# Altium project NZPP.PrjPcb
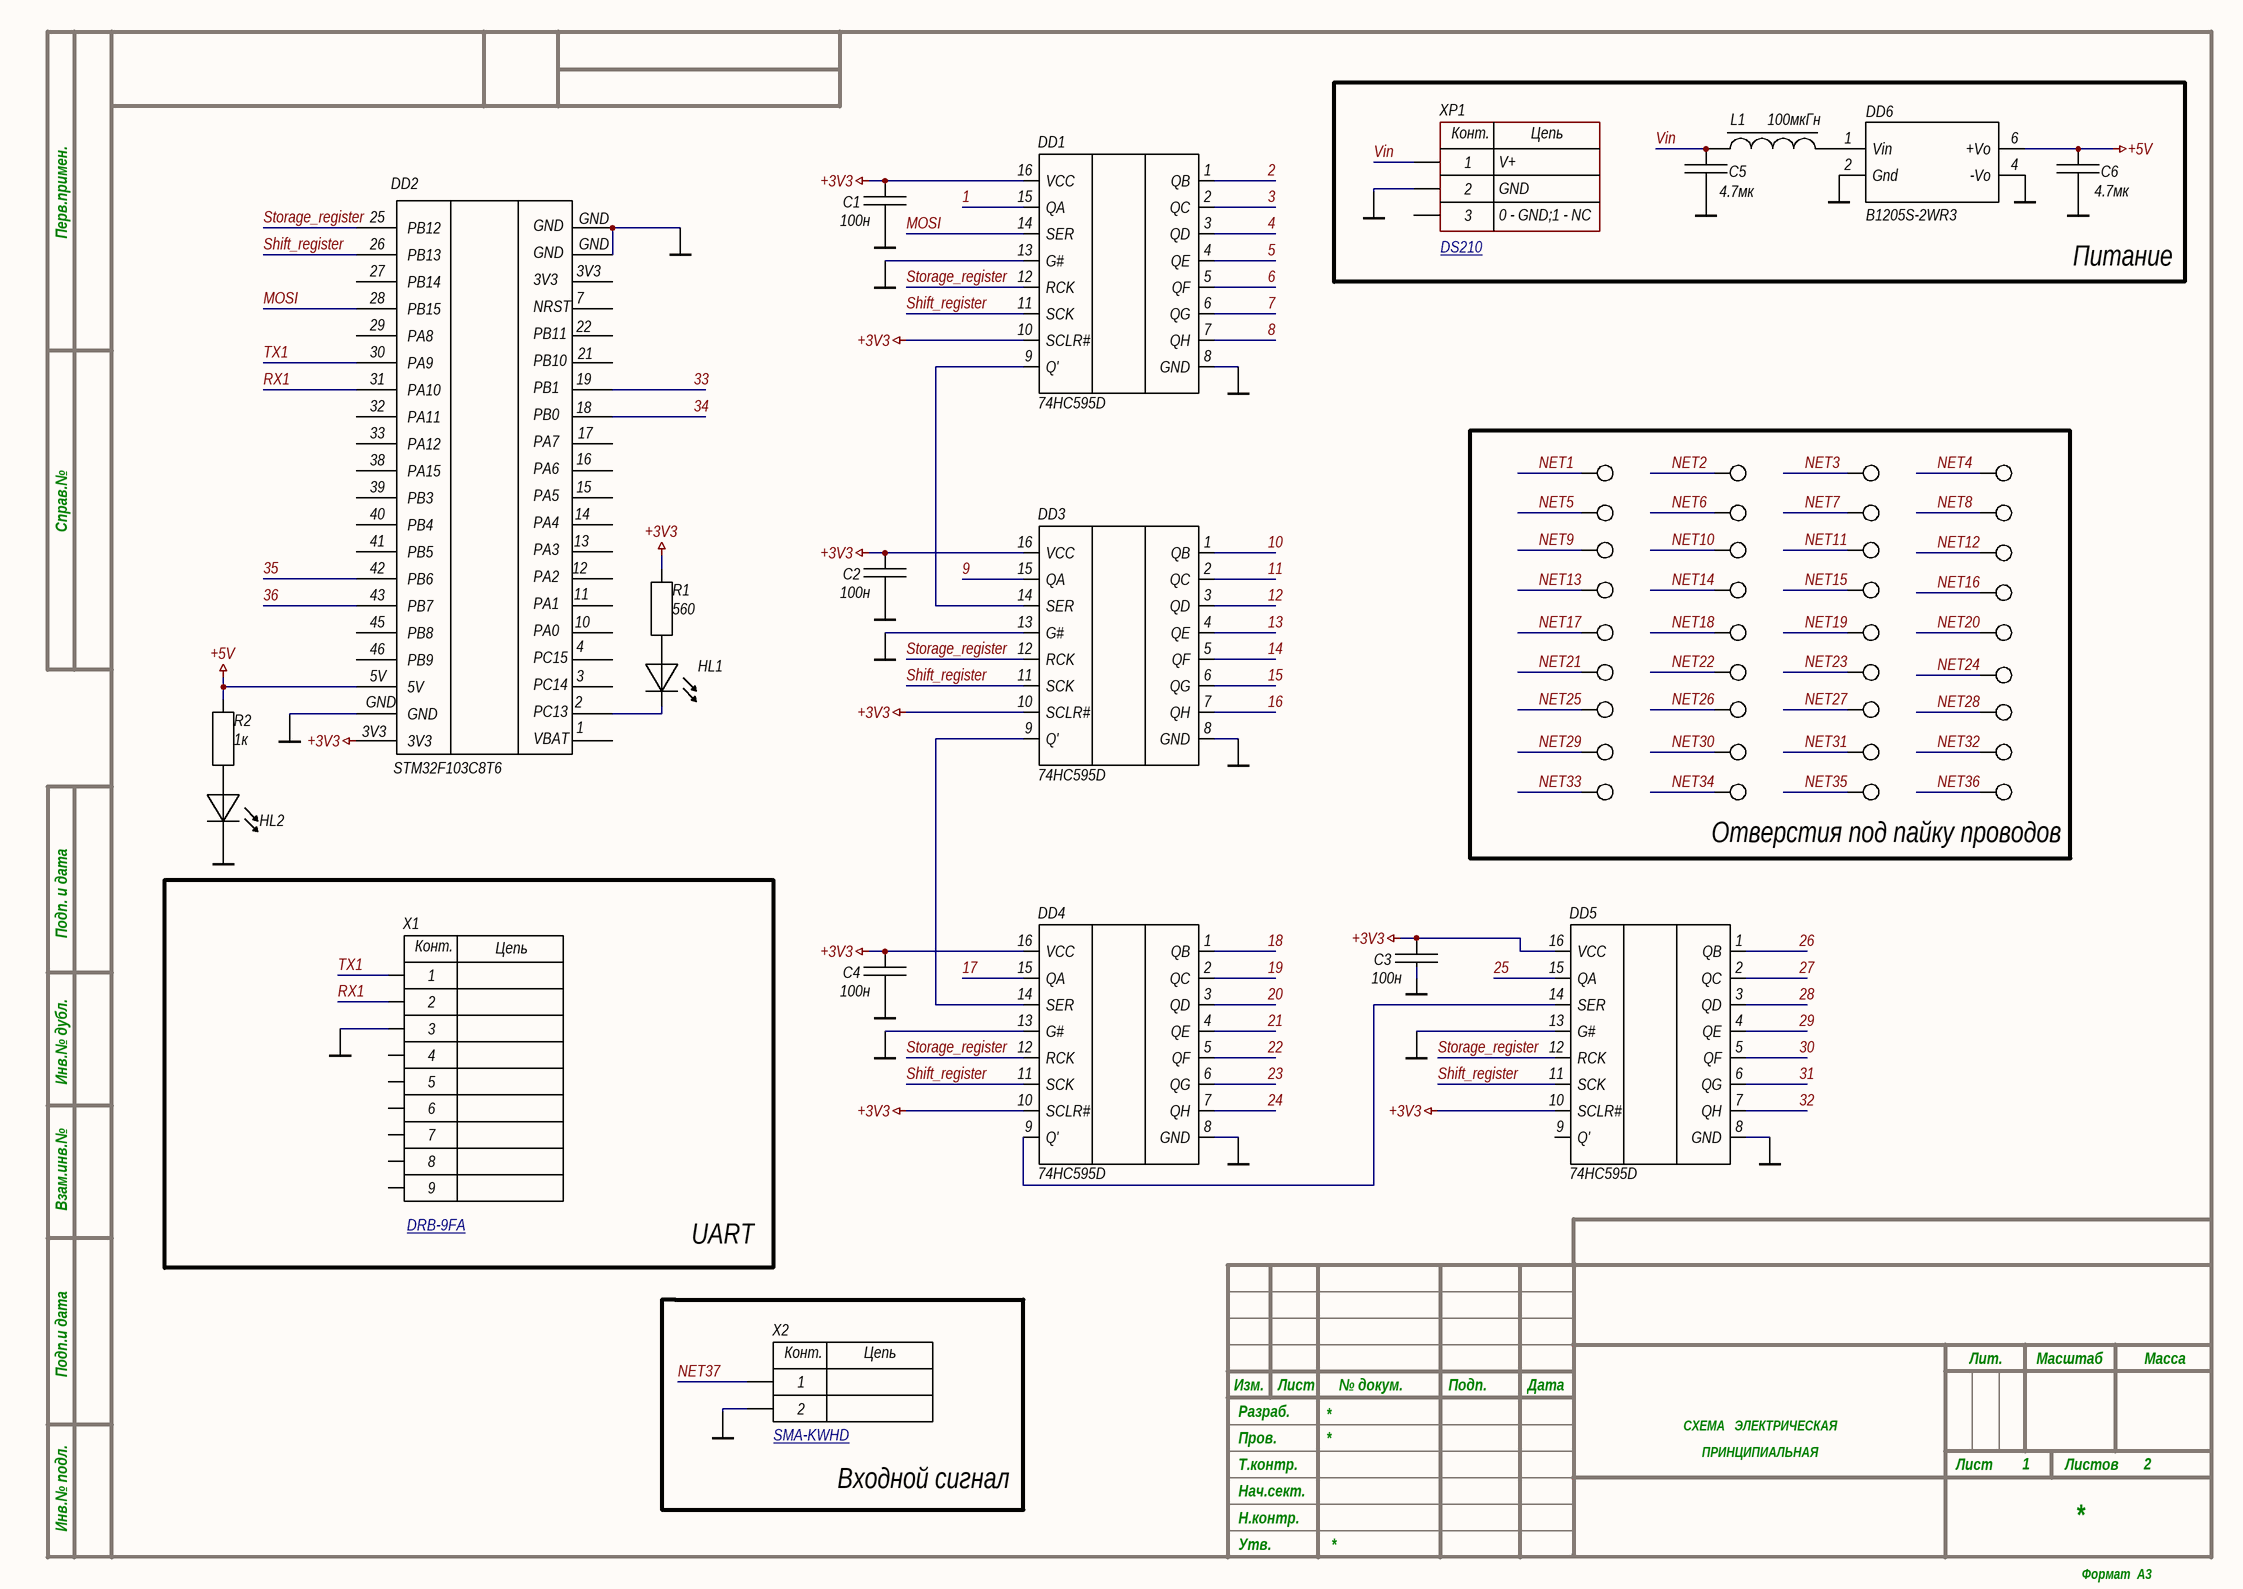
[diagram p0: 1.NZPP.SchDoc]
2 sheets, 164 parts. Net scope: global (net labels, ports and power ports of the same name join across sheets).
Board file: NZPP.PcbDoc
Sheets:
  1.NZPP.SchDoc
  2.NZPP.SchDoc

## Sheet 1.NZPP.SchDoc
size 420 x 297 mm; SheetNumber: 1; SheetTotal: 2

### Parts
*  Point  [Point]  (value not drawn)
*1  Point  [Point]  (value not drawn)
*2  Point  [Point]  (value not drawn)
*3  Point  [Point]  (value not drawn)
*4  Point  [Point]  (value not drawn)
*5  Point  [Point]  (value not drawn)
*6  Point  [Point]  (value not drawn)
*7  Point  [Point]  (value not drawn)
*8  Point  [Point]  (value not drawn)
*9  Point  [Point]  (value not drawn)
*10  Point  [Point]  (value not drawn)
*11  Point  [Point]  (value not drawn)
*12  Point  [Point]  (value not drawn)
*13  Point  [Point]  (value not drawn)
*14  Point  [Point]  (value not drawn)
*15  Point  [Point]  (value not drawn)
*16  Point  [Point]  (value not drawn)
*17  Point  [Point]  (value not drawn)
*18  Point  [Point]  (value not drawn)
*19  Point  [Point]  (value not drawn)
*20  Point  [Point]  (value not drawn)
*21  Point  [Point]  (value not drawn)
*22  Point  [Point]  (value not drawn)
*23  Point  [Point]  (value not drawn)
*24  Point  [Point]  (value not drawn)
*25  Point  [Point]  (value not drawn)
*26  Point  [Point]  (value not drawn)
*27  Point  [Point]  (value not drawn)
*28  Point  [Point]  (value not drawn)
*29  Point  [Point]  (value not drawn)
*30  Point  [Point]  (value not drawn)
*31  Point  [Point]  (value not drawn)
*32  Point  [Point]  (value not drawn)
*33  Point  [Point]  (value not drawn)
*34  Point  [Point]  (value not drawn)
*35  Point  [Point]  (value not drawn)
C1  100н  [CAP: 0805]
C2  100н  [CAP: 0805]
C3  100н  [CAP: 0805]
C4  100н  [CAP: 0805]
C5  4.7мк  [CAP: 0805]
C6  4.7мк  [CAP: 0805]
DD1  74HC595D  [74HC595D]
DD2  STM32F103C8T6  [STM32F103C8T6 - duplicate]
DD3  74HC595D  [74HC595D]
DD4  74HC595D  [74HC595D]
DD5  74HC595D  [74HC595D]
DD6  B1205S-2WR3  [B1205S-2WR3]
HL1  GNL-3012HD  [led green]  (value not drawn)
HL2  GNL-3012HD  [led]  (value not drawn)
L1  100мкГн  [100мкГн]
R1  560  [RES: 0805]
R2  1к  [RES: 0805]
X1  DRB-9FA  [CON: DB-9F]  (value not drawn)
X2  SMA-KWHD  [CON: SMA-KWHD]  (value not drawn)
XP1  DS210  [CON: DS210]  (value not drawn)

### Blocks framed on the sheet
Питание: C5 C6 DD6 L1 XP1
UART: X1
Входной сигнал: X2

### Nets
+3V3: C1.2 C2.2 C3.2 C4.2 DD1.10(SCLR#) DD1.16(VCC) DD2.A2(3V3) DD3.10(SCLR#) DD3.16(VCC) DD4.10(SCLR#) DD4.16(VCC) DD5.10(SCLR#) DD5.16(VCC) R1.2
+5V: C6.2 DD2.5V DD6.6(+Vo) R2.2
GND: C1.1 C2.1 C3.1 C4.1 C5.1 C6.1 DD1.8(GND) DD1.13(G#) DD2.GND DD3.8(GND) DD3.13(G#) DD4.8(GND) DD4.13(G#) DD5.8(GND) DD5.13(G#) DD6.2(Gnd) DD6.4(-Vo) HL2.2(C) X1.3 X2.2 XP1.2
1: DD1.15(QA)
2: DD1.1(QB)
3: DD1.2(QC)
4: DD1.3(QD)
5: DD1.4(QE)
6: DD1.5(QF)
7: DD1.6(QG)
8: DD1.7(QH)
9: DD3.15(QA)
10: DD3.1(QB)
11: DD3.2(QC)
12: DD3.3(QD)
13: DD3.4(QE)
14: DD3.5(QF)
15: DD3.6(QG)
16: DD3.7(QH)
17: DD4.15(QA)
18: DD4.1(QB)
19: DD4.2(QC)
20: DD4.3(QD)
21: DD4.4(QE)
22: DD4.5(QF)
23: DD4.6(QG)
24: DD4.7(QH)
25: DD5.15(QA)
26: DD5.1(QB)
27: DD5.2(QC)
28: DD5.3(QD)
29: DD5.4(QE)
30: DD5.5(QF)
31: DD5.6(QG)
32: DD5.7(QH)
33: DD2.19(PB1)
34: DD2.18(PB0)
35: DD2.42(PB6)
36: DD2.43(PB7)
MOSI: DD1.14(SER) DD2.28(PB15)
NET1: *.1
NET2: *1.1
NET3: *2.1
NET4: *3.1
NET5: *4.1
NET6: *5.1
NET7: *6.1
NET8: *7.1
NET9: *8.1
NET10: *9.1
NET11: *10.1
NET12: *11.1
NET13: *12.1
NET14: *13.1
NET15: *14.1
NET16: *15.1
NET17: *16.1
NET18: *17.1
NET19: *18.1
NET20: *19.1
NET21: *20.1
NET22: *21.1
NET23: *22.1
NET24: *23.1
NET25: *24.1
NET26: *25.1
NET27: *26.1
NET28: *27.1
NET29: *28.1
NET30: *29.1
NET31: *30.1
NET32: *31.1
NET33: *32.1
NET34: *33.1
NET35: *34.1
NET36: *35.1
NET37: X2.1
RX1: DD2.31(PA10) X1.2
Shift_register: DD1.11(SCK) DD2.26(PB13) DD3.11(SCK) DD4.11(SCK) DD5.11(SCK)
Storage_register: DD1.12(RCK) DD2.25(PB12) DD3.12(RCK) DD4.12(RCK) DD5.12(RCK)
TX1: DD2.30(PA9) X1.1
Vin: C5.2 L1.1 XP1.1
NetDD1_9: DD1.9(Q') DD3.14(SER)
NetDD2_2: DD2.2(PC13) HL1.2(C)
NetDD3_9: DD3.9(Q') DD4.14(SER)
NetDD4_9: DD4.9(Q') DD5.14(SER)
NetDD6_1: DD6.1(Vin) L1.2
NetHL1_1: HL1.1(A) R1.1
NetHL2_1: HL2.1(A) R2.1

Not connected (* = marked no-connect by the designer): DD2 1(Vbat) 3(PC14) 4(PC15) 7(NRST) 10(PA0) 11(PA1) 12(PA2) 13(PA3) 14(PA4) 15(PA5) 16(PA6) 17(PA7) 21(PB10) 22(PB11) 27(PB14) 29(PA8) 32(PA11) 33(PA12) 38(PA15) 39(PB3) 40(PB4) 41(PB5) 45(PB8) 46(PB9) A1(3V3); DD5 9(Q'); X1 4 5 6 7 8 9; XP1 3

### Notes on the sheet
- (near XP1) DS210 <https://www.chipdip.ru/product/ds-210b-gnezdo-pitaniya-2-1x5-5mm-na-panel-dragon-city-463130296>
- Отверстия под пайку проводов
- (near X1) DRB-9FA <https://www.chipdip.ru/product/drb-9fa-ds1037-9f-rozetka-9-pin-na-platu-7.2mm-connfly-35208>
- (near X2) SMA-KWHD <https://www.chipdip.ru/product/razemy-sma-kwhd-shaanxi-best-technology-8050009522>
- Перв.примен.
- Справ.№
- Подп. и дата
- Инв.№ дубл.
- Взам.инв.№
- Подп.и дата
- Разраб.
- Изм.
- Лист
- № докум.
- Подп.
- Дата
- Лит.
- Масштаб
- Масса
- Т.контр.
- Пров.
- СХЕМА   ЭЛЕКТРИЧЕСКАЯ
- ПРИНЦИПИАЛЬНАЯ
- Листов
- Инв.№ подл.
- Утв.
- Н.контр.
- Нач.сект.
- Формат  A3
- (in symbol Connector_terminal_2pin) Конт.; Цепь
- (in symbol DRB-9FA) Конт.; Цепь
- (in symbol DS210) Конт.; Цепь; V+; GND; 0 - GND;1 - NC
- (in symbol STM32F103) VBAT

### Library data of the parts
C1-C6 = Ceramic_0805: Наименование: 0805 10мкФ X7R 10%; Примечание: SMD
DD2 = STM32F103
HL1 HL2 = LED
L1 = Дроссель 100мкГн CD43-101K
R1 R2 = Resistor_0805: Наименование: 0805 100кОм; Примечание: SMD
X2 = Connector_terminal_2pin: Наименование: DG350-3.5-02P-14
X1 = DRB-9FA: Наименование: DRB-9FA
XP1 = DS210: Valuerus: DS210; Value: DS210

## Sheet 2.NZPP.SchDoc
size 420 x 297 mm; SheetNumber: 2; SheetTotal: 2
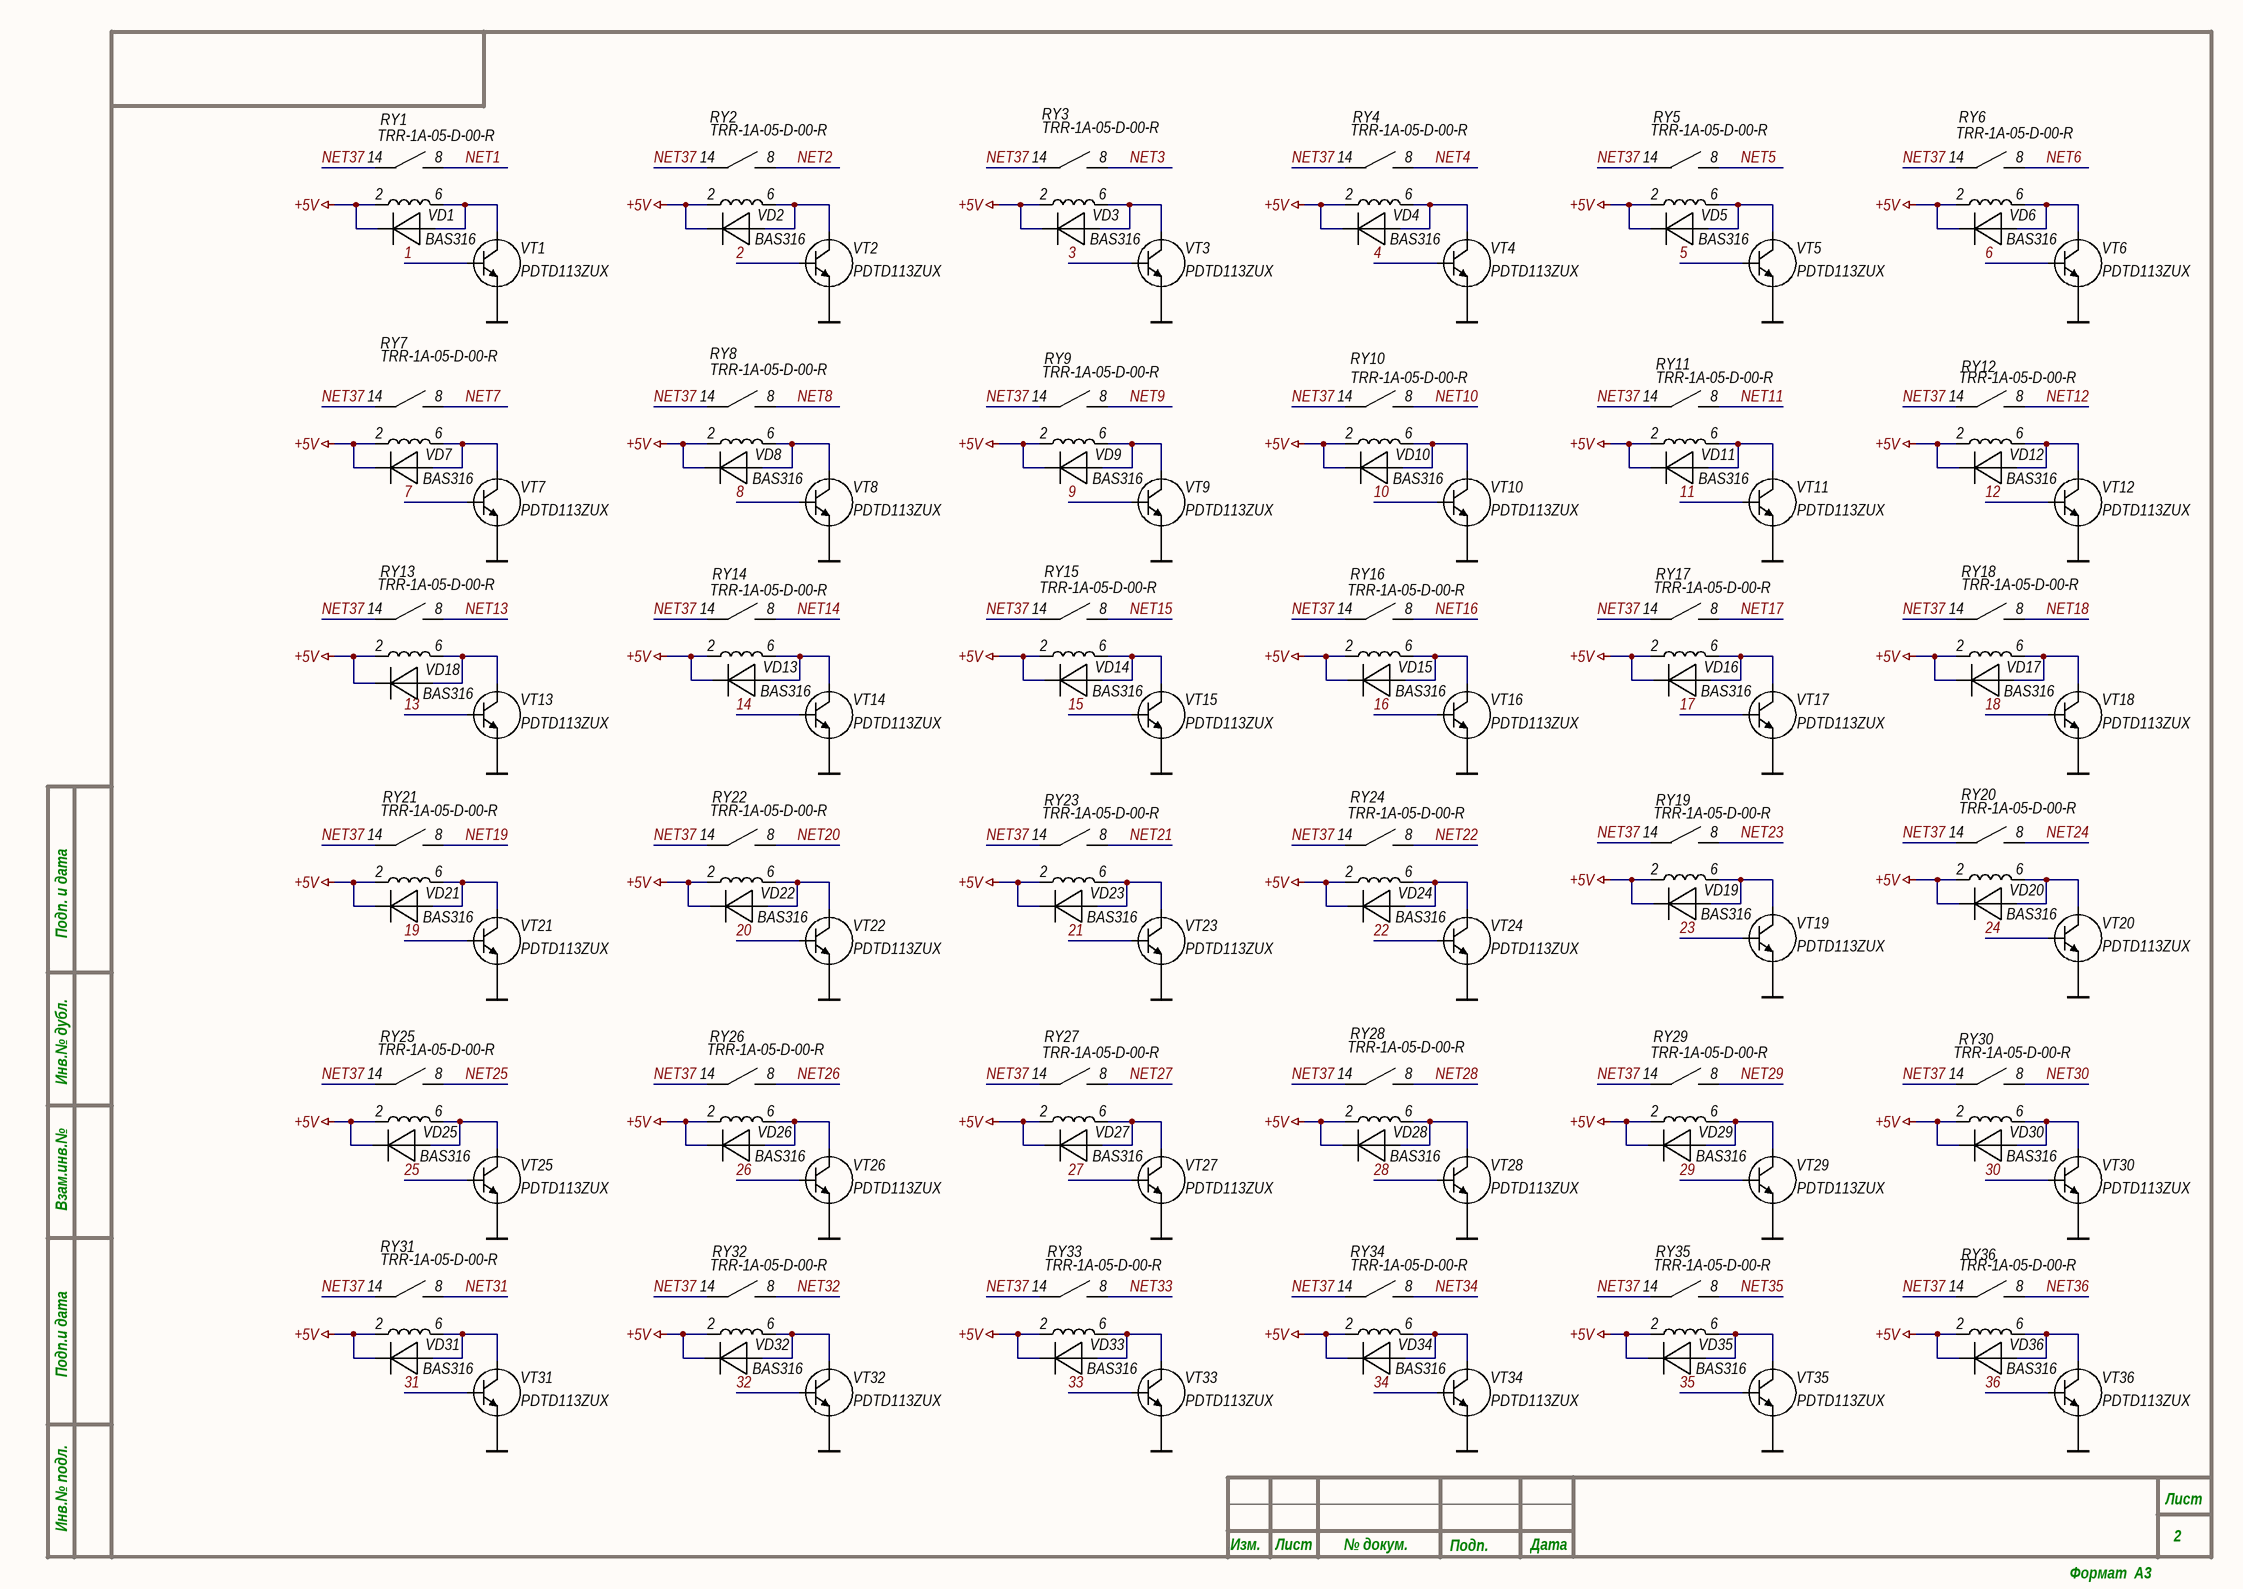
[diagram p1: 2.NZPP.SchDoc]

### Parts
RY1  TRR-1A-05-D-00-R  [TRR-1A-05-D-00-R]
RY2  TRR-1A-05-D-00-R  [TRR-1A-05-D-00-R]
RY3  TRR-1A-05-D-00-R  [TRR-1A-05-D-00-R]
RY4  TRR-1A-05-D-00-R  [TRR-1A-05-D-00-R]
RY5  TRR-1A-05-D-00-R  [TRR-1A-05-D-00-R]
RY6  TRR-1A-05-D-00-R  [TRR-1A-05-D-00-R]
RY7  TRR-1A-05-D-00-R  [TRR-1A-05-D-00-R]
RY8  TRR-1A-05-D-00-R  [TRR-1A-05-D-00-R]
RY9  TRR-1A-05-D-00-R  [TRR-1A-05-D-00-R]
RY10  TRR-1A-05-D-00-R  [TRR-1A-05-D-00-R]
RY11  TRR-1A-05-D-00-R  [TRR-1A-05-D-00-R]
RY12  TRR-1A-05-D-00-R  [TRR-1A-05-D-00-R]
RY13  TRR-1A-05-D-00-R  [TRR-1A-05-D-00-R]
RY14  TRR-1A-05-D-00-R  [TRR-1A-05-D-00-R]
RY15  TRR-1A-05-D-00-R  [TRR-1A-05-D-00-R]
RY16  TRR-1A-05-D-00-R  [TRR-1A-05-D-00-R]
RY17  TRR-1A-05-D-00-R  [TRR-1A-05-D-00-R]
RY18  TRR-1A-05-D-00-R  [TRR-1A-05-D-00-R]
RY19  TRR-1A-05-D-00-R  [TRR-1A-05-D-00-R]
RY20  TRR-1A-05-D-00-R  [TRR-1A-05-D-00-R]
RY21  TRR-1A-05-D-00-R  [TRR-1A-05-D-00-R]
RY22  TRR-1A-05-D-00-R  [TRR-1A-05-D-00-R]
RY23  TRR-1A-05-D-00-R  [TRR-1A-05-D-00-R]
RY24  TRR-1A-05-D-00-R  [TRR-1A-05-D-00-R]
RY25  TRR-1A-05-D-00-R  [TRR-1A-05-D-00-R]
RY26  TRR-1A-05-D-00-R  [TRR-1A-05-D-00-R]
RY27  TRR-1A-05-D-00-R  [TRR-1A-05-D-00-R]
RY28  TRR-1A-05-D-00-R  [TRR-1A-05-D-00-R]
RY29  TRR-1A-05-D-00-R  [TRR-1A-05-D-00-R]
RY30  TRR-1A-05-D-00-R  [TRR-1A-05-D-00-R]
RY31  TRR-1A-05-D-00-R  [TRR-1A-05-D-00-R]
RY32  TRR-1A-05-D-00-R  [TRR-1A-05-D-00-R]
RY33  TRR-1A-05-D-00-R  [TRR-1A-05-D-00-R]
RY34  TRR-1A-05-D-00-R  [TRR-1A-05-D-00-R]
RY35  TRR-1A-05-D-00-R  [TRR-1A-05-D-00-R]
RY36  TRR-1A-05-D-00-R  [TRR-1A-05-D-00-R]
VD1  BAS316  [DIODE: SOD323]
VD2  BAS316  [DIODE: SOD323]
VD3  BAS316  [DIODE: SOD323]
VD4  BAS316  [DIODE: SOD323]
VD5  BAS316  [DIODE: SOD323]
VD6  BAS316  [DIODE: SOD323]
VD7  BAS316  [DIODE: SOD323]
VD8  BAS316  [DIODE: SOD323]
VD9  BAS316  [DIODE: SOD323]
VD10  BAS316  [DIODE: SOD323]
VD11  BAS316  [DIODE: SOD323]
VD12  BAS316  [DIODE: SOD323]
VD13  BAS316  [DIODE: SOD323]
VD14  BAS316  [DIODE: SOD323]
VD15  BAS316  [DIODE: SOD323]
VD16  BAS316  [DIODE: SOD323]
VD17  BAS316  [DIODE: SOD323]
VD18  BAS316  [DIODE: SOD323]
VD19  BAS316  [DIODE: SOD323]
VD20  BAS316  [DIODE: SOD323]
VD21  BAS316  [DIODE: SOD323]
VD22  BAS316  [DIODE: SOD323]
VD23  BAS316  [DIODE: SOD323]
VD24  BAS316  [DIODE: SOD323]
VD25  BAS316  [DIODE: SOD323]
VD26  BAS316  [DIODE: SOD323]
VD27  BAS316  [DIODE: SOD323]
VD28  BAS316  [DIODE: SOD323]
VD29  BAS316  [DIODE: SOD323]
VD30  BAS316  [DIODE: SOD323]
VD31  BAS316  [DIODE: SOD323]
VD32  BAS316  [DIODE: SOD323]
VD33  BAS316  [DIODE: SOD323]
VD34  BAS316  [DIODE: SOD323]
VD35  BAS316  [DIODE: SOD323]
VD36  BAS316  [DIODE: SOD323]
VT1  PDTD113ZUX  [SC-70]
VT2  PDTD113ZUX  [SC-70]
VT3  PDTD113ZUX  [SC-70]
VT4  PDTD113ZUX  [SC-70]
VT5  PDTD113ZUX  [SC-70]
VT6  PDTD113ZUX  [SC-70]
VT7  PDTD113ZUX  [SC-70]
VT8  PDTD113ZUX  [SC-70]
VT9  PDTD113ZUX  [SC-70]
VT10  PDTD113ZUX  [SC-70]
VT11  PDTD113ZUX  [SC-70]
VT12  PDTD113ZUX  [SC-70]
VT13  PDTD113ZUX  [SC-70]
VT14  PDTD113ZUX  [SC-70]
VT15  PDTD113ZUX  [SC-70]
VT16  PDTD113ZUX  [SC-70]
VT17  PDTD113ZUX  [SC-70]
VT18  PDTD113ZUX  [SC-70]
VT19  PDTD113ZUX  [SC-70]
VT20  PDTD113ZUX  [SC-70]
VT21  PDTD113ZUX  [SC-70]
VT22  PDTD113ZUX  [SC-70]
VT23  PDTD113ZUX  [SC-70]
VT24  PDTD113ZUX  [SC-70]
VT25  PDTD113ZUX  [SC-70]
VT26  PDTD113ZUX  [SC-70]
VT27  PDTD113ZUX  [SC-70]
VT28  PDTD113ZUX  [SC-70]
VT29  PDTD113ZUX  [SC-70]
VT30  PDTD113ZUX  [SC-70]
VT31  PDTD113ZUX  [SC-70]
VT32  PDTD113ZUX  [SC-70]
VT33  PDTD113ZUX  [SC-70]
VT34  PDTD113ZUX  [SC-70]
VT35  PDTD113ZUX  [SC-70]
VT36  PDTD113ZUX  [SC-70]

### Nets
+5V: RY1.2 RY2.2 RY3.2 RY4.2 RY5.2 RY6.2 RY7.2 RY8.2 RY9.2 RY10.2 RY11.2 RY12.2 RY13.2 RY14.2 RY15.2 RY16.2 RY17.2 RY18.2 RY19.2 RY20.2 RY21.2 RY22.2 RY23.2 RY24.2 RY25.2 RY26.2 RY27.2 RY28.2 RY29.2 RY30.2 RY31.2 RY32.2 RY33.2 RY34.2 RY35.2 RY36.2 VD1.2 VD2.2 VD3.2 VD4.2 VD5.2 VD6.2 VD7.2 VD8.2 VD9.2 VD10.2 VD11.2 VD12.2 VD13.2 VD14.2 VD15.2 VD16.2 VD17.2 VD18.2 VD19.2 VD20.2 VD21.2 VD22.2 VD23.2 VD24.2 VD25.2 VD26.2 VD27.2 VD28.2 VD29.2 VD30.2 VD31.2 VD32.2 VD33.2 VD34.2 VD35.2 VD36.2
GND: VT1.2(E) VT2.2(E) VT3.2(E) VT4.2(E) VT5.2(E) VT6.2(E) VT7.2(E) VT8.2(E) VT9.2(E) VT10.2(E) VT11.2(E) VT12.2(E) VT13.2(E) VT14.2(E) VT15.2(E) VT16.2(E) VT17.2(E) VT18.2(E) VT19.2(E) VT20.2(E) VT21.2(E) VT22.2(E) VT23.2(E) VT24.2(E) VT25.2(E) VT26.2(E) VT27.2(E) VT28.2(E) VT29.2(E) VT30.2(E) VT31.2(E) VT32.2(E) VT33.2(E) VT34.2(E) VT35.2(E) VT36.2(E)
1: VT1.1(B)
2: VT2.1(B)
3: VT3.1(B)
4: VT4.1(B)
5: VT5.1(B)
6: VT6.1(B)
7: VT7.1(B)
8: VT8.1(B)
9: VT9.1(B)
10: VT10.1(B)
11: VT11.1(B)
12: VT12.1(B)
13: VT13.1(B)
14: VT14.1(B)
15: VT15.1(B)
16: VT16.1(B)
17: VT17.1(B)
18: VT18.1(B)
19: VT21.1(B)
20: VT22.1(B)
21: VT23.1(B)
22: VT24.1(B)
23: VT19.1(B)
24: VT20.1(B)
25: VT25.1(B)
26: VT26.1(B)
27: VT27.1(B)
28: VT28.1(B)
29: VT29.1(B)
30: VT30.1(B)
31: VT31.1(B)
32: VT32.1(B)
33: VT33.1(B)
34: VT34.1(B)
35: VT35.1(B)
36: VT36.1(B)
NET1: RY1.8
NET2: RY2.8
NET3: RY3.8
NET4: RY4.8
NET5: RY5.8
NET6: RY6.8
NET7: RY7.8
NET8: RY8.8
NET9: RY9.8
NET10: RY10.8
NET11: RY11.8
NET12: RY12.8
NET13: RY13.8
NET14: RY14.8
NET15: RY15.8
NET16: RY16.8
NET17: RY17.8
NET18: RY18.8
NET19: RY21.8
NET20: RY22.8
NET21: RY23.8
NET22: RY24.8
NET23: RY19.8
NET24: RY20.8
NET25: RY25.8
NET26: RY26.8
NET27: RY27.8
NET28: RY28.8
NET29: RY29.8
NET30: RY30.8
NET31: RY31.8
NET32: RY32.8
NET33: RY33.8
NET34: RY34.8
NET35: RY35.8
NET36: RY36.8
NET37: RY1.14 RY2.14 RY3.14 RY4.14 RY5.14 RY6.14 RY7.14 RY8.14 RY9.14 RY10.14 RY11.14 RY12.14 RY13.14 RY14.14 RY15.14 RY16.14 RY17.14 RY18.14 RY19.14 RY20.14 RY21.14 RY22.14 RY23.14 RY24.14 RY25.14 RY26.14 RY27.14 RY28.14 RY29.14 RY30.14 RY31.14 RY32.14 RY33.14 RY34.14 RY35.14 RY36.14
NetRY1_6: RY1.6 VD1.1 VT1.3(C)
NetRY2_6: RY2.6 VD2.1 VT2.3(C)
NetRY3_6: RY3.6 VD3.1 VT3.3(C)
NetRY4_6: RY4.6 VD4.1 VT4.3(C)
NetRY5_6: RY5.6 VD5.1 VT5.3(C)
NetRY6_6: RY6.6 VD6.1 VT6.3(C)
NetRY7_6: RY7.6 VD7.1 VT7.3(C)
NetRY8_6: RY8.6 VD8.1 VT8.3(C)
NetRY9_6: RY9.6 VD9.1 VT9.3(C)
NetRY10_6: RY10.6 VD10.1 VT10.3(C)
NetRY11_6: RY11.6 VD11.1 VT11.3(C)
NetRY12_6: RY12.6 VD12.1 VT12.3(C)
NetRY13_6: RY13.6 VD18.1 VT13.3(C)
NetRY14_6: RY14.6 VD13.1 VT14.3(C)
NetRY15_6: RY15.6 VD14.1 VT15.3(C)
NetRY16_6: RY16.6 VD15.1 VT16.3(C)
NetRY17_6: RY17.6 VD16.1 VT17.3(C)
NetRY18_6: RY18.6 VD17.1 VT18.3(C)
NetRY19_6: RY19.6 VD19.1 VT19.3(C)
NetRY20_6: RY20.6 VD20.1 VT20.3(C)
NetRY21_6: RY21.6 VD21.1 VT21.3(C)
NetRY22_6: RY22.6 VD22.1 VT22.3(C)
NetRY23_6: RY23.6 VD23.1 VT23.3(C)
NetRY24_6: RY24.6 VD24.1 VT24.3(C)
NetRY25_6: RY25.6 VD25.1 VT25.3(C)
NetRY26_6: RY26.6 VD26.1 VT26.3(C)
NetRY27_6: RY27.6 VD27.1 VT27.3(C)
NetRY28_6: RY28.6 VD28.1 VT28.3(C)
NetRY29_6: RY29.6 VD29.1 VT29.3(C)
NetRY30_6: RY30.6 VD30.1 VT30.3(C)
NetRY31_6: RY31.6 VD31.1 VT31.3(C)
NetRY32_6: RY32.6 VD32.1 VT32.3(C)
NetRY33_6: RY33.6 VD33.1 VT33.3(C)
NetRY34_6: RY34.6 VD34.1 VT34.3(C)
NetRY35_6: RY35.6 VD35.1 VT35.3(C)
NetRY36_6: RY36.6 VD36.1 VT36.3(C)

### Notes on the sheet
- Подп. и дата
- Инв.№ дубл.
- Взам.инв.№
- Подп.и дата
- Инв.№ подл.
- Изм.
- Лист
- № докум.
- Подп.
- Дата
- Формат  A3

### Library data of the parts
VD1-VD36 = Diode_single: Наименование: 1N4148; Примечание: SMD
VT1-VT36 = BJT_NPN_132: Manufacturer: ON Semiconductor; ValueManufacturerPartNumber: NPN transistor, 45V, 100mA, 100MHz, 300mW, 0.6V, 420, SOT-23, -55...+125°C; TypeTransistor: NPN transistor; VoltageCE: 45V; CurrentCE: 100mA; VoltageSaturation: 0.6V; Frequency: 100MHz; CurrentGain: 420; MaxPower: 300mW; Package: SOT-23; HelpURL: https://www.digikey.com/product-detail/en/on-semiconductor/BC847CLT1G/BC847CLT1GOSCT-ND/917836; Temperature: -55...+125°C; PartNumber: PDTD113ZUX

## Nets that join several sheets
+5V: 1.NZPP (C6.2 DD2.5V DD6.6 R2.2), 2.NZPP (72 pins)
GND: 1.NZPP (21 pins), 2.NZPP (36 pins)
1: 1.NZPP (DD1.15), 2.NZPP (VT1.1)
2: 1.NZPP (DD1.1), 2.NZPP (VT2.1)
3: 1.NZPP (DD1.2), 2.NZPP (VT3.1)
4: 1.NZPP (DD1.3), 2.NZPP (VT4.1)
5: 1.NZPP (DD1.4), 2.NZPP (VT5.1)
6: 1.NZPP (DD1.5), 2.NZPP (VT6.1)
7: 1.NZPP (DD1.6), 2.NZPP (VT7.1)
8: 1.NZPP (DD1.7), 2.NZPP (VT8.1)
9: 1.NZPP (DD3.15), 2.NZPP (VT9.1)
10: 1.NZPP (DD3.1), 2.NZPP (VT10.1)
11: 1.NZPP (DD3.2), 2.NZPP (VT11.1)
12: 1.NZPP (DD3.3), 2.NZPP (VT12.1)
13: 1.NZPP (DD3.4), 2.NZPP (VT13.1)
14: 1.NZPP (DD3.5), 2.NZPP (VT14.1)
15: 1.NZPP (DD3.6), 2.NZPP (VT15.1)
16: 1.NZPP (DD3.7), 2.NZPP (VT16.1)
17: 1.NZPP (DD4.15), 2.NZPP (VT17.1)
18: 1.NZPP (DD4.1), 2.NZPP (VT18.1)
19: 1.NZPP (DD4.2), 2.NZPP (VT21.1)
20: 1.NZPP (DD4.3), 2.NZPP (VT22.1)
21: 1.NZPP (DD4.4), 2.NZPP (VT23.1)
22: 1.NZPP (DD4.5), 2.NZPP (VT24.1)
23: 1.NZPP (DD4.6), 2.NZPP (VT19.1)
24: 1.NZPP (DD4.7), 2.NZPP (VT20.1)
25: 1.NZPP (DD5.15), 2.NZPP (VT25.1)
26: 1.NZPP (DD5.1), 2.NZPP (VT26.1)
27: 1.NZPP (DD5.2), 2.NZPP (VT27.1)
28: 1.NZPP (DD5.3), 2.NZPP (VT28.1)
29: 1.NZPP (DD5.4), 2.NZPP (VT29.1)
30: 1.NZPP (DD5.5), 2.NZPP (VT30.1)
31: 1.NZPP (DD5.6), 2.NZPP (VT31.1)
32: 1.NZPP (DD5.7), 2.NZPP (VT32.1)
33: 1.NZPP (DD2.19), 2.NZPP (VT33.1)
34: 1.NZPP (DD2.18), 2.NZPP (VT34.1)
35: 1.NZPP (DD2.42), 2.NZPP (VT35.1)
36: 1.NZPP (DD2.43), 2.NZPP (VT36.1)
NET1: 1.NZPP (*.1), 2.NZPP (RY1.8)
NET2: 1.NZPP (*1.1), 2.NZPP (RY2.8)
NET3: 1.NZPP (*2.1), 2.NZPP (RY3.8)
NET4: 1.NZPP (*3.1), 2.NZPP (RY4.8)
NET5: 1.NZPP (*4.1), 2.NZPP (RY5.8)
NET6: 1.NZPP (*5.1), 2.NZPP (RY6.8)
NET7: 1.NZPP (*6.1), 2.NZPP (RY7.8)
NET8: 1.NZPP (*7.1), 2.NZPP (RY8.8)
NET9: 1.NZPP (*8.1), 2.NZPP (RY9.8)
NET10: 1.NZPP (*9.1), 2.NZPP (RY10.8)
NET11: 1.NZPP (*10.1), 2.NZPP (RY11.8)
NET12: 1.NZPP (*11.1), 2.NZPP (RY12.8)
NET13: 1.NZPP (*12.1), 2.NZPP (RY13.8)
NET14: 1.NZPP (*13.1), 2.NZPP (RY14.8)
NET15: 1.NZPP (*14.1), 2.NZPP (RY15.8)
NET16: 1.NZPP (*15.1), 2.NZPP (RY16.8)
NET17: 1.NZPP (*16.1), 2.NZPP (RY17.8)
NET18: 1.NZPP (*17.1), 2.NZPP (RY18.8)
NET19: 1.NZPP (*18.1), 2.NZPP (RY21.8)
NET20: 1.NZPP (*19.1), 2.NZPP (RY22.8)
NET21: 1.NZPP (*20.1), 2.NZPP (RY23.8)
NET22: 1.NZPP (*21.1), 2.NZPP (RY24.8)
NET23: 1.NZPP (*22.1), 2.NZPP (RY19.8)
NET24: 1.NZPP (*23.1), 2.NZPP (RY20.8)
NET25: 1.NZPP (*24.1), 2.NZPP (RY25.8)
NET26: 1.NZPP (*25.1), 2.NZPP (RY26.8)
NET27: 1.NZPP (*26.1), 2.NZPP (RY27.8)
NET28: 1.NZPP (*27.1), 2.NZPP (RY28.8)
NET29: 1.NZPP (*28.1), 2.NZPP (RY29.8)
NET30: 1.NZPP (*29.1), 2.NZPP (RY30.8)
NET31: 1.NZPP (*30.1), 2.NZPP (RY31.8)
NET32: 1.NZPP (*31.1), 2.NZPP (RY32.8)
NET33: 1.NZPP (*32.1), 2.NZPP (RY33.8)
NET34: 1.NZPP (*33.1), 2.NZPP (RY34.8)
NET35: 1.NZPP (*34.1), 2.NZPP (RY35.8)
NET36: 1.NZPP (*35.1), 2.NZPP (RY36.8)
NET37: 1.NZPP (X2.1), 2.NZPP (36 pins)